# Altium project haptic_gloves.PrjPcb
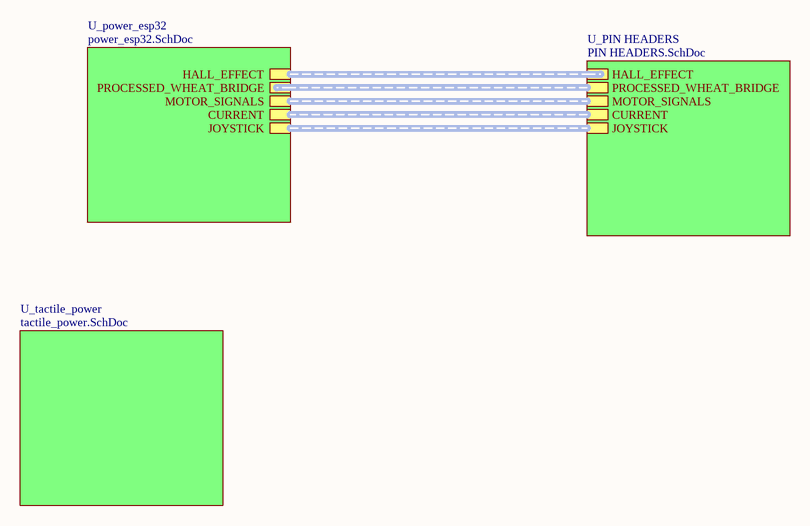
[diagram p0: MASTER_BLOXK.SchDoc]
5 sheets, 33 parts. Net scope: hierarchical (ports join the sheet entries above them; power ports are global).
Board file: SINGLE_BOARD.PcbDoc
Sheets:
  esp32-PLACEMENT.SchDoc
  MASTER_BLOXK.SchDoc
    U_PIN HEADERS = PIN HEADERS.SchDoc
    U_power_esp32 = power_esp32.SchDoc
    U_tactile_power = tactile_power.SchDoc

## Sheet esp32-PLACEMENT.SchDoc
size B; SheetNumber: 3; SheetTotal: 5

## Sheet MASTER_BLOXK.SchDoc
size B; SheetNumber: 2; SheetTotal: 5

### Sub-sheets
U_PIN HEADERS = PIN HEADERS.SchDoc: HALL_EFFECT (harness HALL_EFFECT), PROCESSED_WHEAT_BRIDGE (harness PROCES WHEAT_BRIDGE), CURRENT (harness current_sensors), MOTOR_SIGNALS (harness MOTOR_SIGNALS), JOYSTICK (harness JOY_STICK_)
U_power_esp32 = power_esp32.SchDoc: HALL_EFFECT (harness HALL_EFFECT), PROCESSED_WHEAT_BRIDGE (harness PROCES WHEAT_BRIDGE), MOTOR_SIGNALS (harness MOTOR_SIGNALS), CURRENT (harness current_sensors), JOYSTICK (harness JOY_STICK_)
U_tactile_power = tactile_power.SchDoc: no entries

### Buses and harness runs
harness sheet U_PIN HEADERS/CURRENT = sheet U_power_esp32/CURRENT
harness sheet U_PIN HEADERS/HALL_EFFECT = sheet U_power_esp32/HALL_EFFECT
harness sheet U_PIN HEADERS/JOYSTICK = sheet U_power_esp32/JOYSTICK
harness sheet U_PIN HEADERS/MOTOR_SIGNALS = sheet U_power_esp32/MOTOR_SIGNALS
harness sheet U_PIN HEADERS/PROCESSED_WHEAT_BRIDGE = sheet U_power_esp32/PROCESSED_WHEAT_BRIDGE

## Sheet PIN HEADERS.SchDoc
size B; SheetNumber: 4; SheetTotal: 5
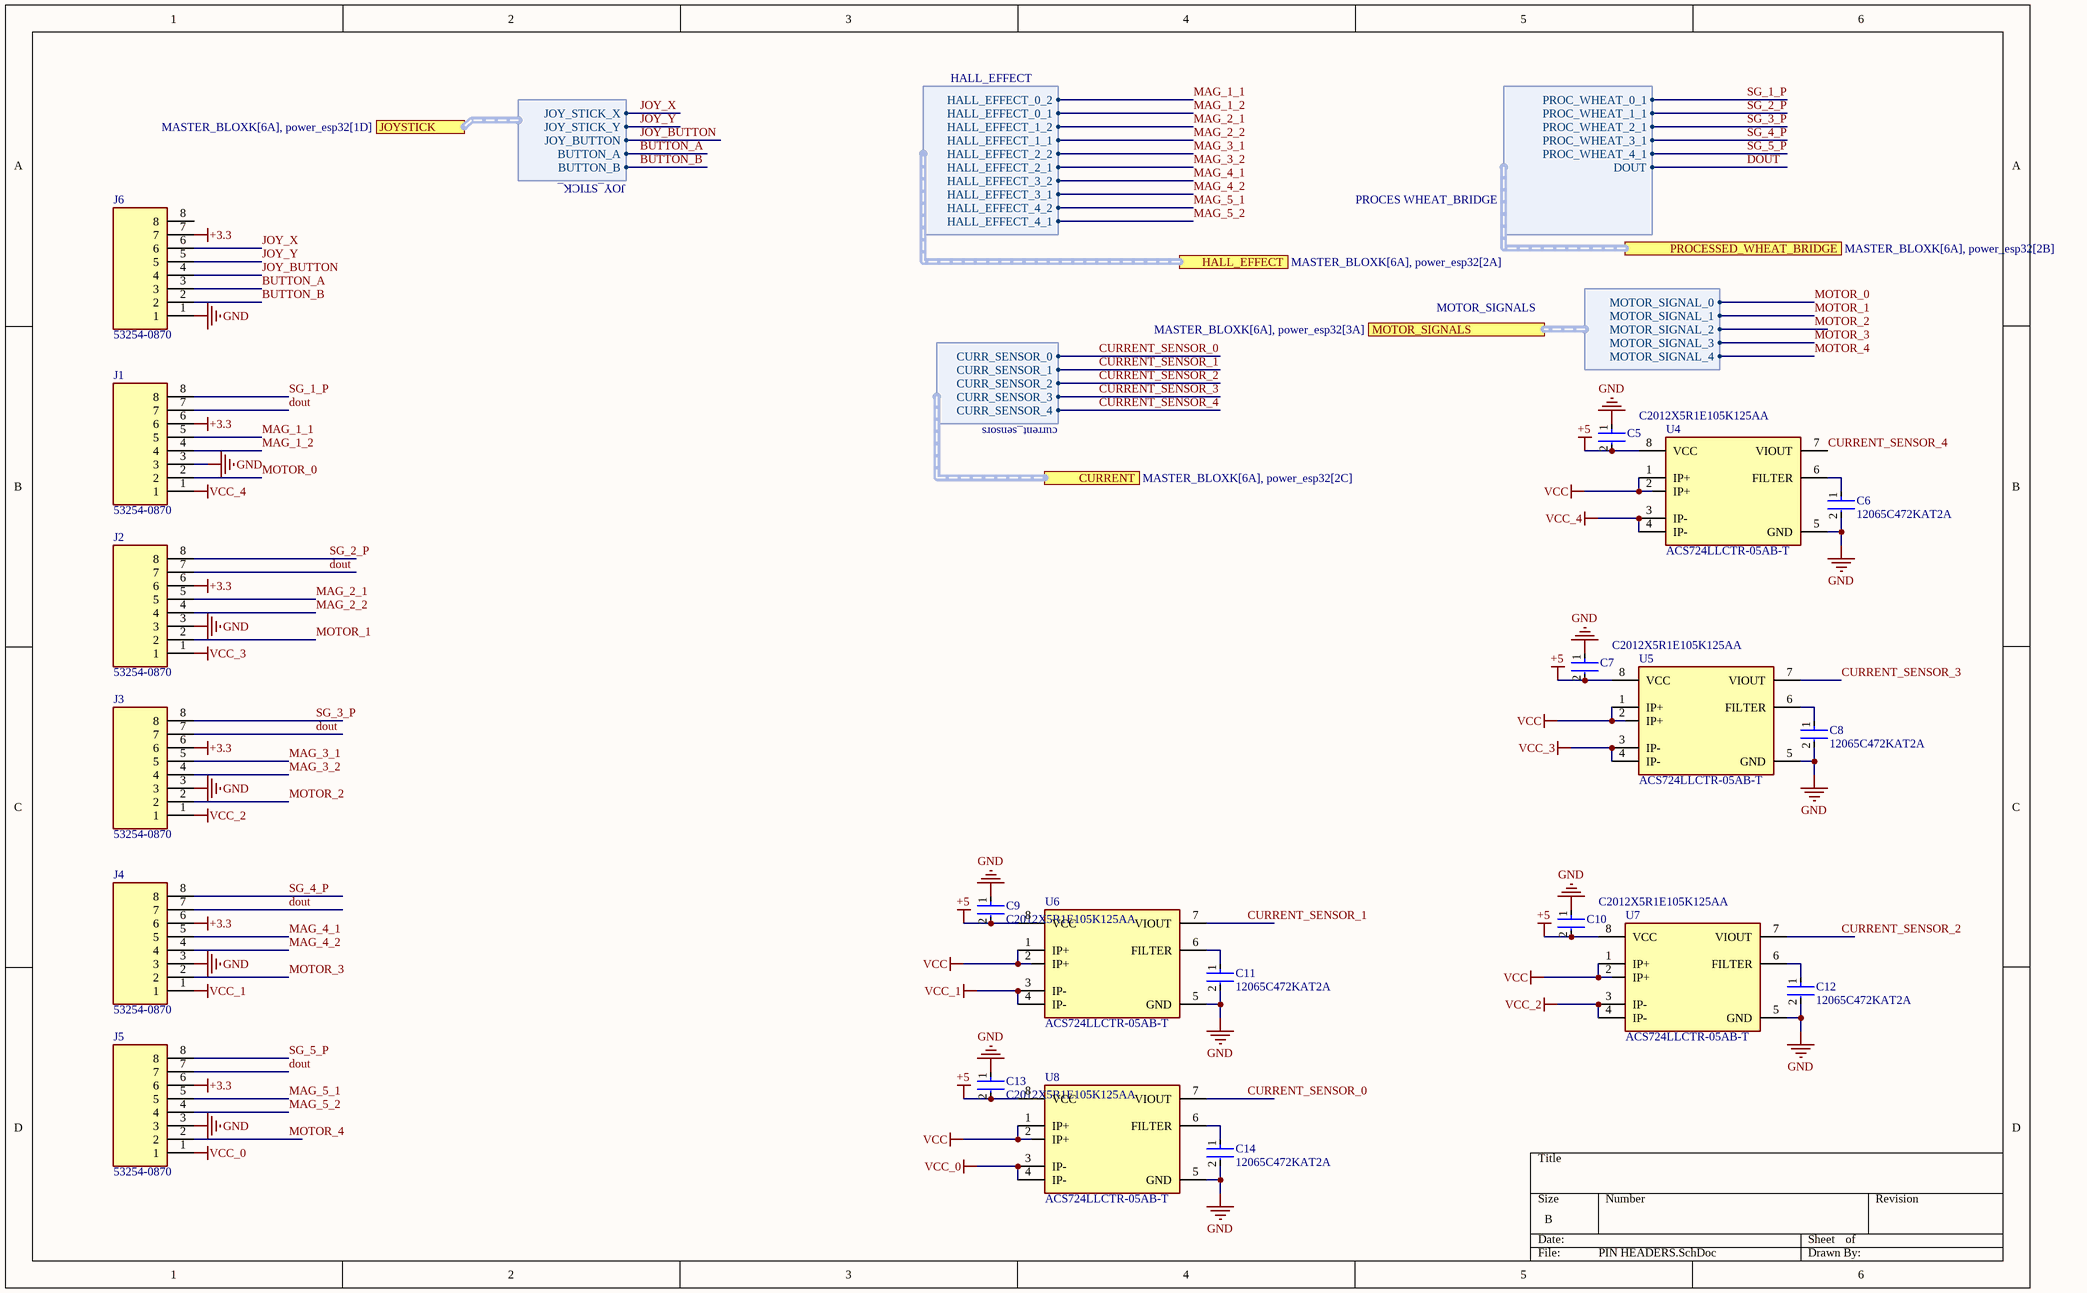
[diagram p1: PIN HEADERS.SchDoc]

### Parts
C5  C2012X5R1E105K125AA  [FP-C2012-125-0_2-IPC_A]
C6  12065C472KAT2A  [FP-1206-L_3_2_0_2-W_1_6_0-IPC_A]
C7  C2012X5R1E105K125AA  [FP-C2012-125-0_2-IPC_A]
C8  12065C472KAT2A  [FP-1206-L_3_2_0_2-W_1_6_0-IPC_A]
C9  C2012X5R1E105K125AA  [FP-C2012-125-0_2-IPC_A]
C10  C2012X5R1E105K125AA  [FP-C2012-125-0_2-IPC_A]
C11  12065C472KAT2A  [FP-1206-L_3_2_0_2-W_1_6_0-IPC_A]
C12  12065C472KAT2A  [FP-1206-L_3_2_0_2-W_1_6_0-IPC_A]
C13  C2012X5R1E105K125AA  [FP-C2012-125-0_2-IPC_A]
C14  12065C472KAT2A  [FP-1206-L_3_2_0_2-W_1_6_0-IPC_A]
J1  53254-0870  [SHDRRA8W50P0X200_1X8_1800X730X440P]
J2  53254-0870  [SHDRRA8W50P0X200_1X8_1800X730X440P]
J3  53254-0870  [SHDRRA8W50P0X200_1X8_1800X730X440P]
J4  53254-0870  [SHDRRA8W50P0X200_1X8_1800X730X440P]
J5  53254-0870  [SHDRRA8W50P0X200_1X8_1800X730X440P]
J6  53254-0870  [SHDRRA8W50P0X200_1X8_1800X730X440P]
U4  ACS724LLCTR-05AB-T  [FP-LCN-8-IPC_C]
U5  ACS724LLCTR-05AB-T  [FP-LCN-8-IPC_C]
U6  ACS724LLCTR-05AB-T  [FP-LCN-8-IPC_C]
U7  ACS724LLCTR-05AB-T  [FP-LCN-8-IPC_C]
U8  ACS724LLCTR-05AB-T  [FP-LCN-8-IPC_C]

### Ports
CURRENT (harness current_sensors, see MASTER_BLOXK[6A], power_esp32[2C]), HALL_EFFECT (harness HALL_EFFECT, see MASTER_BLOXK[6A], power_esp32[2A]), JOYSTICK (harness JOY_STICK_, see MASTER_BLOXK[6A], power_esp32[1D]), MOTOR_SIGNALS (harness MOTOR_SIGNALS, see MASTER_BLOXK[6A], power_esp32[3A]), PROCESSED_WHEAT_BRIDGE (harness PROCES WHEAT_BRIDGE, see MASTER_BLOXK[6A], power_esp32[2B])

### Harnesses
HALL_EFFECT: HALL_EFFECT_2_1, HALL_EFFECT_3_2, HALL_EFFECT_3_1, HALL_EFFECT_4_2, HALL_EFFECT_4_1, HALL_EFFECT_2_2, HALL_EFFECT_1_1, HALL_EFFECT_1_2, HALL_EFFECT_0_1, HALL_EFFECT_0_2
PROCES WHEAT_BRIDGE: PROC_WHEAT_0_1, PROC_WHEAT_1_1, PROC_WHEAT_2_1, PROC_WHEAT_3_1, PROC_WHEAT_4_1, DOUT
current_sensors: CURR_SENSOR_0, CURR_SENSOR_1, CURR_SENSOR_2, CURR_SENSOR_3, CURR_SENSOR_4
MOTOR_SIGNALS: MOTOR_SIGNAL_0, MOTOR_SIGNAL_1, MOTOR_SIGNAL_2, MOTOR_SIGNAL_3, MOTOR_SIGNAL_4
JOY_STICK_: JOY_STICK_X, JOY_STICK_Y, JOY_BUTTON, BUTTON_A, BUTTON_B

### Nets
+3.3: J1.6 J2.6 J3.6 J4.6 J5.6 J6.7
+5: C5.2 C7.2 C9.2 C10.2 C13.2 U4.8(VCC) U5.8(VCC) U6.8(VCC) U7.8(VCC) U8.8(VCC)
GND: C5.1 C6.2 C7.1 C8.2 C9.1 C10.1 C11.2 C12.2 C13.1 C14.2 J1.3 J2.3 J3.3 J4.3 J5.3 J6.1 U4.5(GND) U5.5(GND) U6.5(GND) U7.5(GND) U8.5(GND)
VCC: U4.1(IP+) U4.2(IP+) U5.1(IP+) U5.2(IP+) U6.1(IP+) U6.2(IP+) U7.1(IP+) U7.2(IP+) U8.1(IP+) U8.2(IP+)
VCC_0: J5.1 U8.3(IP-) U8.4(IP-)
VCC_1: J4.1 U6.3(IP-) U6.4(IP-)
VCC_2: J3.1 U7.3(IP-) U7.4(IP-)
VCC_3: J2.1 U5.3(IP-) U5.4(IP-)
VCC_4: J1.1 U4.3(IP-) U4.4(IP-)
BUTTON_A: J6.3 ; port JOYSTICK.BUTTON_A
BUTTON_B: J6.2 ; port JOYSTICK.BUTTON_B
CURRENT_SENSOR_0: U8.7(VIOUT) ; port CURRENT.CURR_SENSOR_0
CURRENT_SENSOR_1: U6.7(VIOUT) ; port CURRENT.CURR_SENSOR_1
CURRENT_SENSOR_2: U7.7(VIOUT) ; port CURRENT.CURR_SENSOR_2
CURRENT_SENSOR_3: U5.7(VIOUT) ; port CURRENT.CURR_SENSOR_3
CURRENT_SENSOR_4: U4.7(VIOUT) ; port CURRENT.CURR_SENSOR_4
dout: J1.7 J2.7 J3.7 J4.7 J5.7 ; port PROCESSED_WHEAT_BRIDGE.DOUT
JOY_BUTTON: J6.4 ; port JOYSTICK.JOY_BUTTON
JOY_X: J6.6 ; port JOYSTICK.JOY_STICK_X
JOY_Y: J6.5 ; port JOYSTICK.JOY_STICK_Y
MAG_1_1: J1.5 ; port HALL_EFFECT.HALL_EFFECT_0_2
MAG_1_2: J1.4 ; port HALL_EFFECT.HALL_EFFECT_0_1
MAG_2_1: J2.5 ; port HALL_EFFECT.HALL_EFFECT_1_2
MAG_2_2: J2.4 ; port HALL_EFFECT.HALL_EFFECT_1_1
MAG_3_1: J3.5 ; port HALL_EFFECT.HALL_EFFECT_2_2
MAG_3_2: J3.4 ; port HALL_EFFECT.HALL_EFFECT_2_1
MAG_4_1: J4.5 ; port HALL_EFFECT.HALL_EFFECT_3_2
MAG_4_2: J4.4 ; port HALL_EFFECT.HALL_EFFECT_3_1
MAG_5_1: J5.5 ; port HALL_EFFECT.HALL_EFFECT_4_2
MAG_5_2: J5.4 ; port HALL_EFFECT.HALL_EFFECT_4_1
MOTOR_0: J1.2 ; port MOTOR_SIGNALS.MOTOR_SIGNAL_0
MOTOR_1: J2.2 ; port MOTOR_SIGNALS.MOTOR_SIGNAL_1
MOTOR_2: J3.2 ; port MOTOR_SIGNALS.MOTOR_SIGNAL_2
MOTOR_3: J4.2 ; port MOTOR_SIGNALS.MOTOR_SIGNAL_3
MOTOR_4: J5.2 ; port MOTOR_SIGNALS.MOTOR_SIGNAL_4
SG_1_P: J1.8 ; port PROCESSED_WHEAT_BRIDGE.PROC_WHEAT_0_1
SG_2_P: J2.8 ; port PROCESSED_WHEAT_BRIDGE.PROC_WHEAT_1_1
SG_3_P: J3.8 ; port PROCESSED_WHEAT_BRIDGE.PROC_WHEAT_2_1
SG_4_P: J4.8 ; port PROCESSED_WHEAT_BRIDGE.PROC_WHEAT_3_1
SG_5_P: J5.8 ; port PROCESSED_WHEAT_BRIDGE.PROC_WHEAT_4_1
NetC6_1: C6.1 U4.6(FILTER)
NetC8_1: C8.1 U5.6(FILTER)
NetC11_1: C11.1 U6.6(FILTER)
NetC12_1: C12.1 U7.6(FILTER)
NetC14_1: C14.1 U8.6(FILTER)

Not connected (* = marked no-connect by the designer): J6 8

### Library data of the parts
C5 C7 C9 C10 C13 = CMP-08246-005389-1: Multilayer Ceramic Capacitors 1μF ±10% 25V X5R SMD 0805; Capacitance: 1uF; Min Operating Temperature: -55°C; Construction: Flat; Package Quantity: 2000; Height: 1.25mm; Resistor Type: Ceramic; Case/Package: 0805; Depth: 1.25mm; Case Code (Metric): 2012; Weight: 0.000194oz; REACH SVHC: No SVHC; Dielectric: X5R; Max Operating Temperature: 85°C; Number of Pins: 2; Thickness: 0.057inch; RoHS Compliant: Yes; Radiation Hardening: No; Lead Free: Lead Free; Case Code (Imperial): 0805; Length: 2mm; Voltage Rating: 25V; Mount: Surface Mount; Voltage Rating (DC): 25V; Packaging: Tape and Reel; Dielectric Material: Ceramic; Termination: SMD/SMT; Voltage: 25V; Tolerance: 10%; Series: C; Width: 0.049inch
C6 C8 C11 C12 C14 = CMP-04427-019159-1: General Purpose Ceramic Capacitor, 1206, 4.7nF, 10%, X7R, 15%, 50V; Dissipation Factor: 2.5%; Min Operating Temperature: -55°C; Length: 3.2mm; Mount: Surface Mount; Case Code (Metric): 3216; Depth: 1.6mm; Voltage Rating (DC): 50V; Dielectric Material: Ceramic; Termination: SMD/SMT; Radiation Hardening: No; Voltage: 50V; Capacitance: 4.7nF; Dielectric: X7R; Series: -; Max Operating Temperature: 125°C; Lead Free: Lead Free; Number of Pins: 2; Tolerance: 10%; Thickness: 0.037inch; Packaging: Tape and Reel; Package Quantity: 1; Case/Package: 1206; Contact Plating: Tin; Construction: Flat; Height: 0.94mm; Voltage Rating: 50V; RoHS Compliant: Yes; Width: 1.6mm; Case Code (Imperial): 1206
J1-J6 = CMP-003-000027-1: Headers & Wire Housings 8CKT WTB R/A; Manufacturer_Name: Molex; Geometry.Height: 4.4mm; Mouser Price/Stock: https://www.mouser.co.uk/ProductDetail/Molex/53254-0870?qs=s16%252Be%252B8QgeFQnKbK1eobMw%3D%3D; Mouser Part Number: 538-53254-0870; Source: 53254-0870.SchLib; Design Item ID: 53254-0870; Manufacturer_Part_Number: 53254-0870; Datasheet Link: https://componentsearchengine.com/Datasheets/2/53254-0870.pdf
U4-U8 = CMP-82923-000070-2: SENSOR CURRENT HALL; Current Sensing: 5A; Number of Channels: 1; Sensitivity: 400mV/A; Linearity: 1.5%; Polarity: Bidirectional; Response Time: 4us; Frequency: 120kHz; Max Supply Current: 14mA; Accuracy: 0.6%; Min Operating Temperature: -40°C; Mount: Surface Mount; Max Operating Temperature: 150°C; Packaging: Tape and Reel; RoHS Compliant: Yes; Case/Package: SOIC

## Sheet power_esp32.SchDoc
size B; SheetNumber: 5; SheetTotal: 5
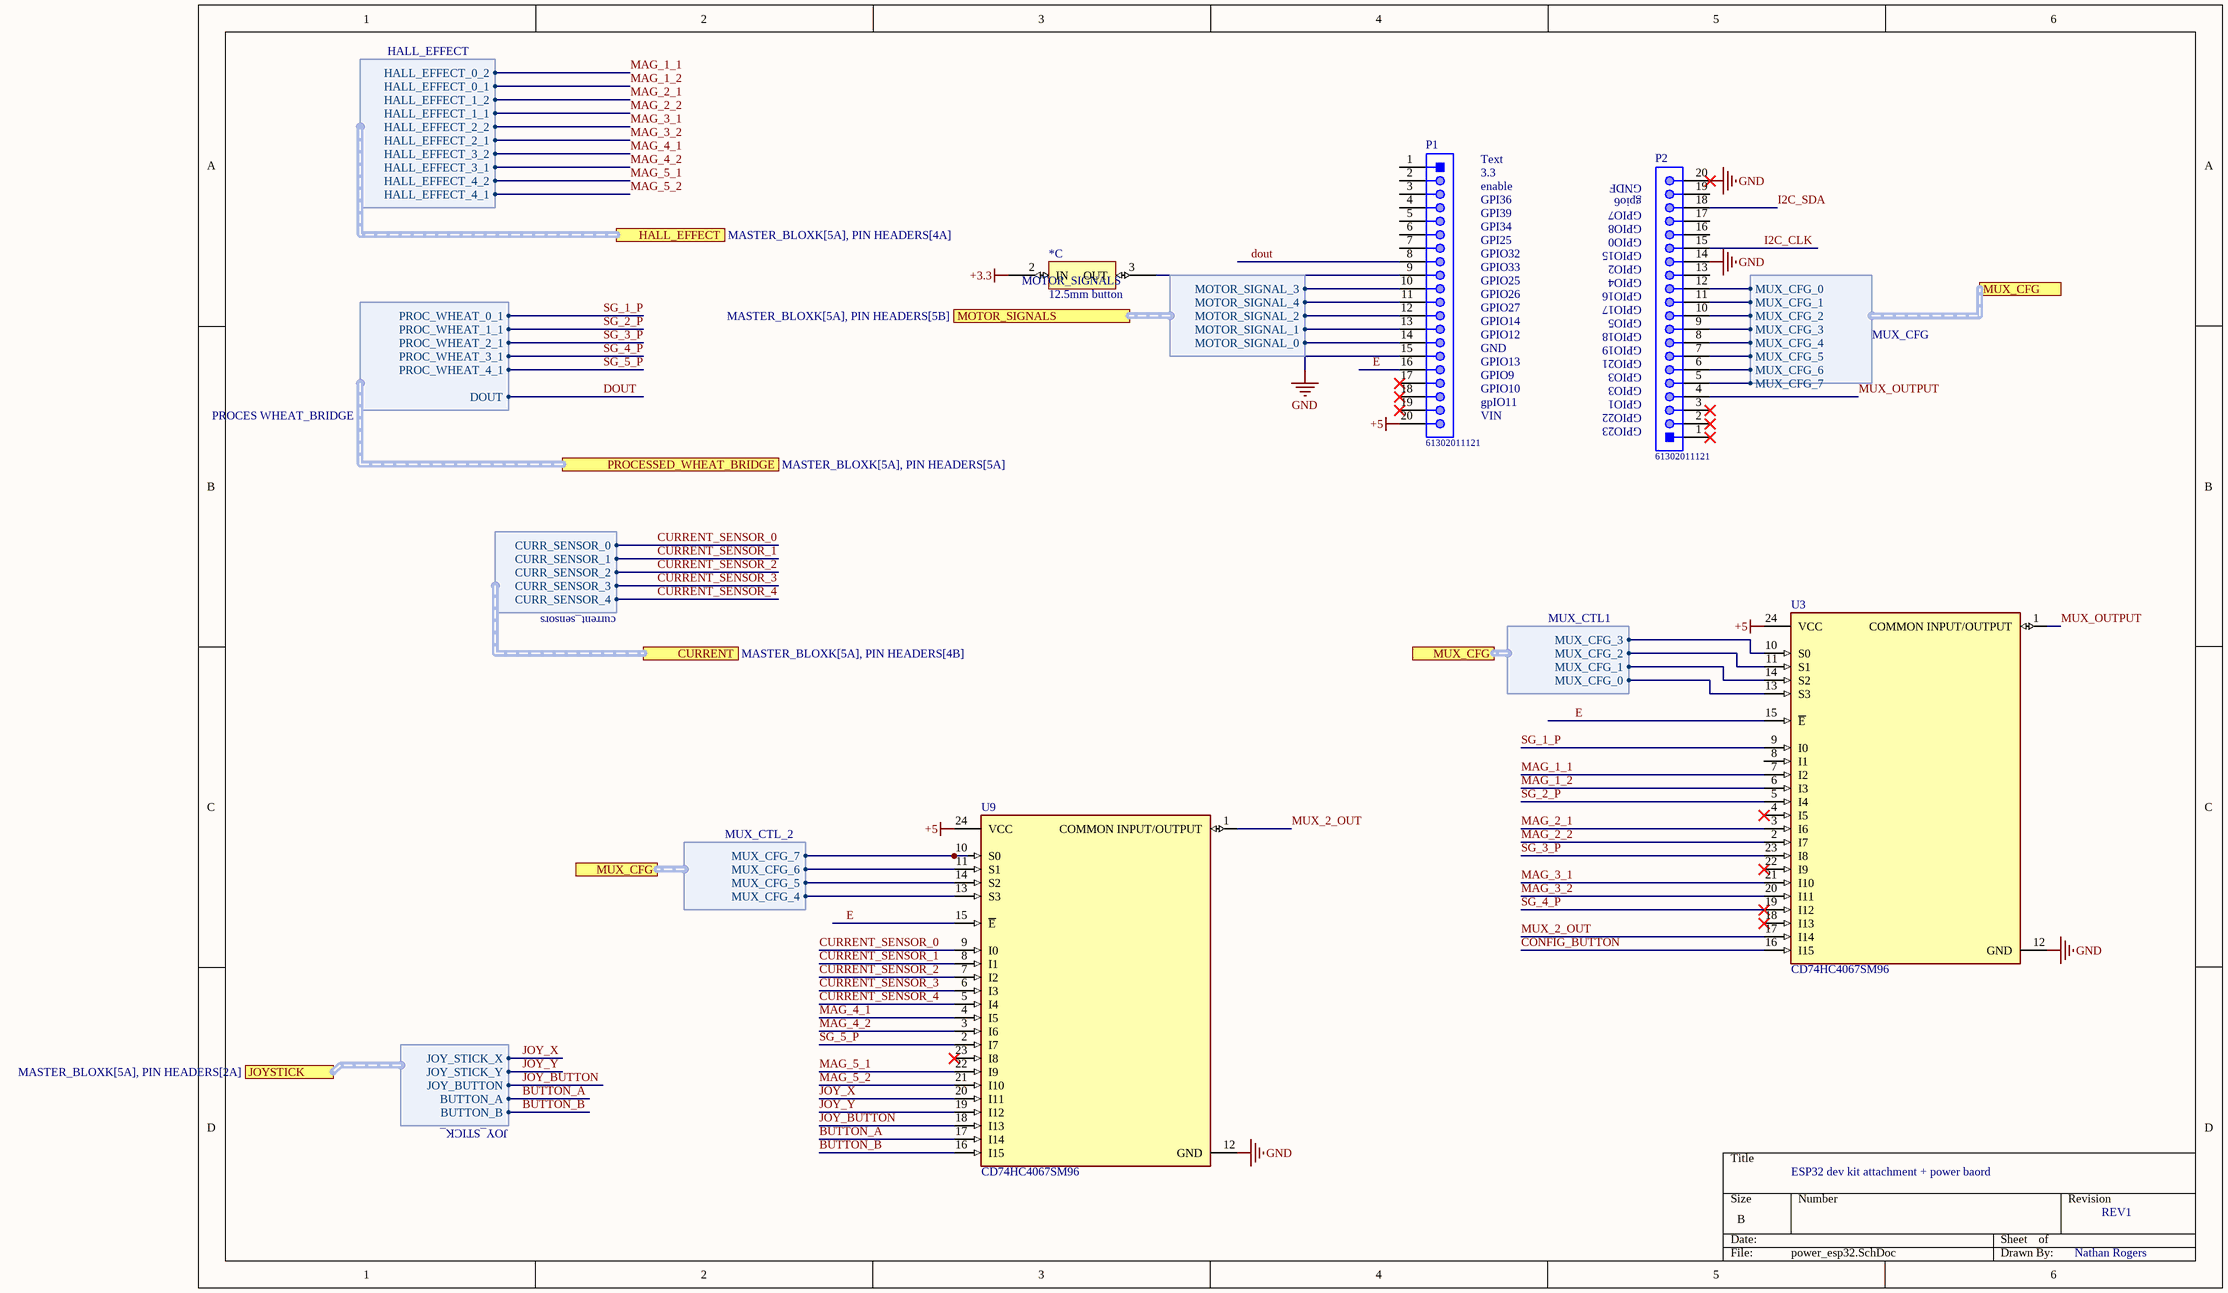
[diagram p2: power_esp32.SchDoc]

### Parts
*  12.5mm button  [12.5mm button-Footprint-1]  (part C of 3)
P1  61302011121  [61302011121]
P2  61302011121  [61302011121]
U3  CD74HC4067SM96  [FP-DB0024A-IPC_C]
U9  CD74HC4067SM96  [FP-DB0024A-IPC_C]

### Ports
CURRENT (harness current_sensors, see MASTER_BLOXK[5A], PIN HEADERS[4B]), HALL_EFFECT (harness HALL_EFFECT, see MASTER_BLOXK[5A], PIN HEADERS[4A]), JOYSTICK (harness JOY_STICK_, see MASTER_BLOXK[5A], PIN HEADERS[2A]), MOTOR_SIGNALS (harness MOTOR_SIGNALS, see MASTER_BLOXK[5A], PIN HEADERS[5B]), MUX_CFG (harness MUX_CFG), MUX_CFG (harness MUX_ctl1), MUX_CFG (harness MUX_CTL_2), PROCESSED_WHEAT_BRIDGE (harness PROCES WHEAT_BRIDGE, see MASTER_BLOXK[5A], PIN HEADERS[5A])

### Harnesses
MUX_CTL1: MUX_CFG_0, MUX_CFG_1, MUX_CFG_2, MUX_CFG_3
HALL_EFFECT: HALL_EFFECT_2_1, HALL_EFFECT_3_2, HALL_EFFECT_3_1, HALL_EFFECT_4_2, HALL_EFFECT_4_1, HALL_EFFECT_2_2, HALL_EFFECT_1_1, HALL_EFFECT_1_2, HALL_EFFECT_0_1, HALL_EFFECT_0_2
PROCES WHEAT_BRIDGE: PROC_WHEAT_0_1, PROC_WHEAT_1_1, PROC_WHEAT_2_1, PROC_WHEAT_3_1, PROC_WHEAT_4_1, DOUT
MUX_CTL_2: MUX_CFG_4, MUX_CFG_5, MUX_CFG_6, MUX_CFG_7
MOTOR_SIGNALS: MOTOR_SIGNAL_0, MOTOR_SIGNAL_1, MOTOR_SIGNAL_2, MOTOR_SIGNAL_3, MOTOR_SIGNAL_4
MUX_CFG: MUX_CFG_0, MUX_CFG_1, MUX_CFG_2, MUX_CFG_3, MUX_CFG_4, MUX_CFG_5, MUX_CFG_6, MUX_CFG_7
current_sensors: CURR_SENSOR_0, CURR_SENSOR_1, CURR_SENSOR_2, CURR_SENSOR_3, CURR_SENSOR_4
JOY_STICK_: JOY_STICK_X, JOY_STICK_Y, JOY_BUTTON, BUTTON_A, BUTTON_B

### Nets
+3.3: *.2(IN)
+5: P1.20 U3.24(VCC) U9.24(VCC)
GND: P1.15 P2.14 P2.20 U3.12(GND) U9.12(GND)
BUTTON_A: U9.17(I14) ; port JOYSTICK.BUTTON_A
BUTTON_B: U9.16(I15) ; port JOYSTICK.BUTTON_B
CONFIG_BUTTON: U3.16(I15)
CURRENT_SENSOR_0: U9.9(I0) ; port CURRENT.CURR_SENSOR_0
CURRENT_SENSOR_1: U9.8(I1) ; port CURRENT.CURR_SENSOR_1
CURRENT_SENSOR_2: U9.7(I2) ; port CURRENT.CURR_SENSOR_2
CURRENT_SENSOR_3: U9.6(I3) ; port CURRENT.CURR_SENSOR_3
CURRENT_SENSOR_4: U9.5(I4) ; port CURRENT.CURR_SENSOR_4
dout: P1.8 ; port PROCESSED_WHEAT_BRIDGE.DOUT
E: P1.16 U3.15(~{E}) U9.15(~{E})
I2C_CLK: P2.15
I2C_SDA: P2.18
JOY_BUTTON: U9.18(I13) ; port JOYSTICK.JOY_BUTTON
JOY_X: U9.20(I11) ; port JOYSTICK.JOY_STICK_X
JOY_Y: U9.19(I12) ; port JOYSTICK.JOY_STICK_Y
MAG_1_1: U3.7(I2) ; port HALL_EFFECT.HALL_EFFECT_0_2
MAG_1_2: U3.6(I3) ; port HALL_EFFECT.HALL_EFFECT_0_1
MAG_2_1: U3.3(I6) ; port HALL_EFFECT.HALL_EFFECT_1_2
MAG_2_2: U3.2(I7) ; port HALL_EFFECT.HALL_EFFECT_1_1
MAG_3_1: U3.21(I10) ; port HALL_EFFECT.HALL_EFFECT_2_2
MAG_3_2: U3.20(I11) ; port HALL_EFFECT.HALL_EFFECT_2_1
MAG_4_1: U9.4(I5) ; port HALL_EFFECT.HALL_EFFECT_3_2
MAG_4_2: U9.3(I6) ; port HALL_EFFECT.HALL_EFFECT_3_1
MAG_5_1: U9.22(I9) ; port HALL_EFFECT.HALL_EFFECT_4_2
MAG_5_2: U9.21(I10) ; port HALL_EFFECT.HALL_EFFECT_4_1
MOTOR_0: P1.14 ; port MOTOR_SIGNALS.MOTOR_SIGNAL_0
MOTOR_1: P1.13 ; port MOTOR_SIGNALS.MOTOR_SIGNAL_1
MOTOR_2: P1.12 ; port MOTOR_SIGNALS.MOTOR_SIGNAL_2
MOTOR_3: P1.10 ; port MOTOR_SIGNALS.MOTOR_SIGNAL_3
MOTOR_4: P1.11 ; port MOTOR_SIGNALS.MOTOR_SIGNAL_4
MUX_2_OUT: U3.17(I14) U9.1(COMMON_INPUT/OUTPUT)
MUX_OUTPUT: P2.4 U3.1(COMMON_INPUT/OUTPUT)
SG_1_P: U3.9(I0) ; port PROCESSED_WHEAT_BRIDGE.PROC_WHEAT_0_1
SG_2_P: U3.5(I4) ; port PROCESSED_WHEAT_BRIDGE.PROC_WHEAT_1_1
SG_3_P: U3.23(I8) ; port PROCESSED_WHEAT_BRIDGE.PROC_WHEAT_2_1
SG_4_P: U3.19(I12) ; port PROCESSED_WHEAT_BRIDGE.PROC_WHEAT_3_1
SG_5_P: U9.2(I7) ; port PROCESSED_WHEAT_BRIDGE.PROC_WHEAT_4_1
Net*_3: *.3(OUT) P1.9
NetP2_5: P2.5 U9.10(S0) ; port MUX_CFG.MUX_CFG_7
NetP2_6: P2.6 U9.11(S1) ; port MUX_CFG.MUX_CFG_6
NetP2_7: P2.7 U9.14(S2) ; port MUX_CFG.MUX_CFG_5
NetP2_8: P2.8 U9.13(S3) ; port MUX_CFG.MUX_CFG_4
NetP2_9: P2.9 U3.10(S0) ; port MUX_CFG.MUX_CFG_3
NetP2_10: P2.10 U3.11(S1) ; port MUX_CFG.MUX_CFG_2
NetP2_11: P2.11 U3.14(S2) ; port MUX_CFG.MUX_CFG_1
NetP2_12: P2.12 U3.13(S3) ; port MUX_CFG.MUX_CFG_0

Not connected (* = marked no-connect by the designer): P1 1 2 3 4 5 6 7 17* 18* 19*; P2 1* 2* 3* 13 16 17 19; U3 4(I5)* 8(I1) 18(I13)* 22(I9)*; U9 23(I8)*

### Notes on the sheet
- Text
- 3.3
- enable
- GPI36
- GPI39
- GPI34
- (near P2) GPIO0
- (near P2) GPIO8
- (near P2) GPIO7
- (near P2) gpio6
- (near P2) GNDF
- GPI25
- GPIO32
- GPIO33
- GPIO25
- GPIO26
- (near P2) GPIO17
- (near P2) GPIO16
- (near P2) GPIO4
- (near P2) GPIO2
- (near P2) GPIO15
- GPIO27
- GPIO14
- GPIO12
- GND
- GPIO13
- (near P2) GPIO3
- (near P2) GPIO21
- (near P2) GPIO19
- (near P2) GPIO18
- (near P2) GPIO5
- GPIO9
- GPIO10
- gpIO11
- VIN
- (near P2) GPIO23
- (near P2) GPIO1
- (near P2) GPIO22
- ESP32 dev kit attachment + power baord
- REV1
- Nathan Rogers

### Library data of the parts
* = CMP-00027-1: Spacer, Round, 1/4 Inch O.D., 1/4 Inch Long, #8 Hole, Phenolic; Throw Configuration: SPST; Actuator Type: Standard; Termination: PC Pin; Mount: Through Hole; Series: -
P1 P2 = CMP-1502-01102-1: THT Vertical Pin Header WR-PHD, Pitch 2.54 mm, Single Row, 20 pins; Manufacturer: Wurth Elektronik; Withstanding Voltage: 500VAC; Gender: Male; Pin Number: 20; Rated Current: 3A; Contact Resistance: 20mOhm; Pitch: 2.54mm; Working Voltage: 250VAC; Publisher: WurthElektronik; Packaging: Bag; Datasheet URL: https://katalog.we-online.de/em/datasheet/6130xx11121.pdf; Row Number: Single; Mounting Technology: THT; Manufacturer URL: http://www.we-online.de; Orientation: Vertical; Package Reference: 61302011121; Part Number: 61302011121; Operating Temperature: -40to105degC
U3 U9 = CMP-04892-000038-1: IC MUX/DEMUX 1X16 24SSOP; Supply Type: Single; High Level Output Current: 25mA; Min Supply Voltage: 2V; Number of Circuits: 16; Max Supply Voltage: 6V; Number of Channels: 1; Turn-On Delay Time: 300ns; Max Supply Current: 8uA; Bandwidth: 89MHz; Turn-Off Delay Time: 290ns; Propagation Delay: 75ns; Logic Function: Multiplexer; On-State Resistance: 160R; Polarity: Non-Inverting; Width: 5.3mm; Case/Package: SSOP; Max Operating Temperature: 125°C; Mount: Surface Mount; Min Operating Temperature: -55°C; REACH SVHC: No SVHC; Contact Plating: Gold; Max Output Current: 25mA; Weight: 0.006081oz; Height: 1.95mm; Package Quantity: 2000; Length: 8.2mm; Lead Free: Lead Free; Operating Supply Current: 8uA; Packaging: Tape and Reel; Series: 74HC; Low Level Output Current: 25mA; Number of Outputs: 1; Termination: SMD/SMT; Number of Inputs: 16; Number of Bits: 16; Radiation Hardening: No; Number of Pins: 24

## Sheet tactile_power.SchDoc
size A; SheetNumber: 1; SheetTotal: 5
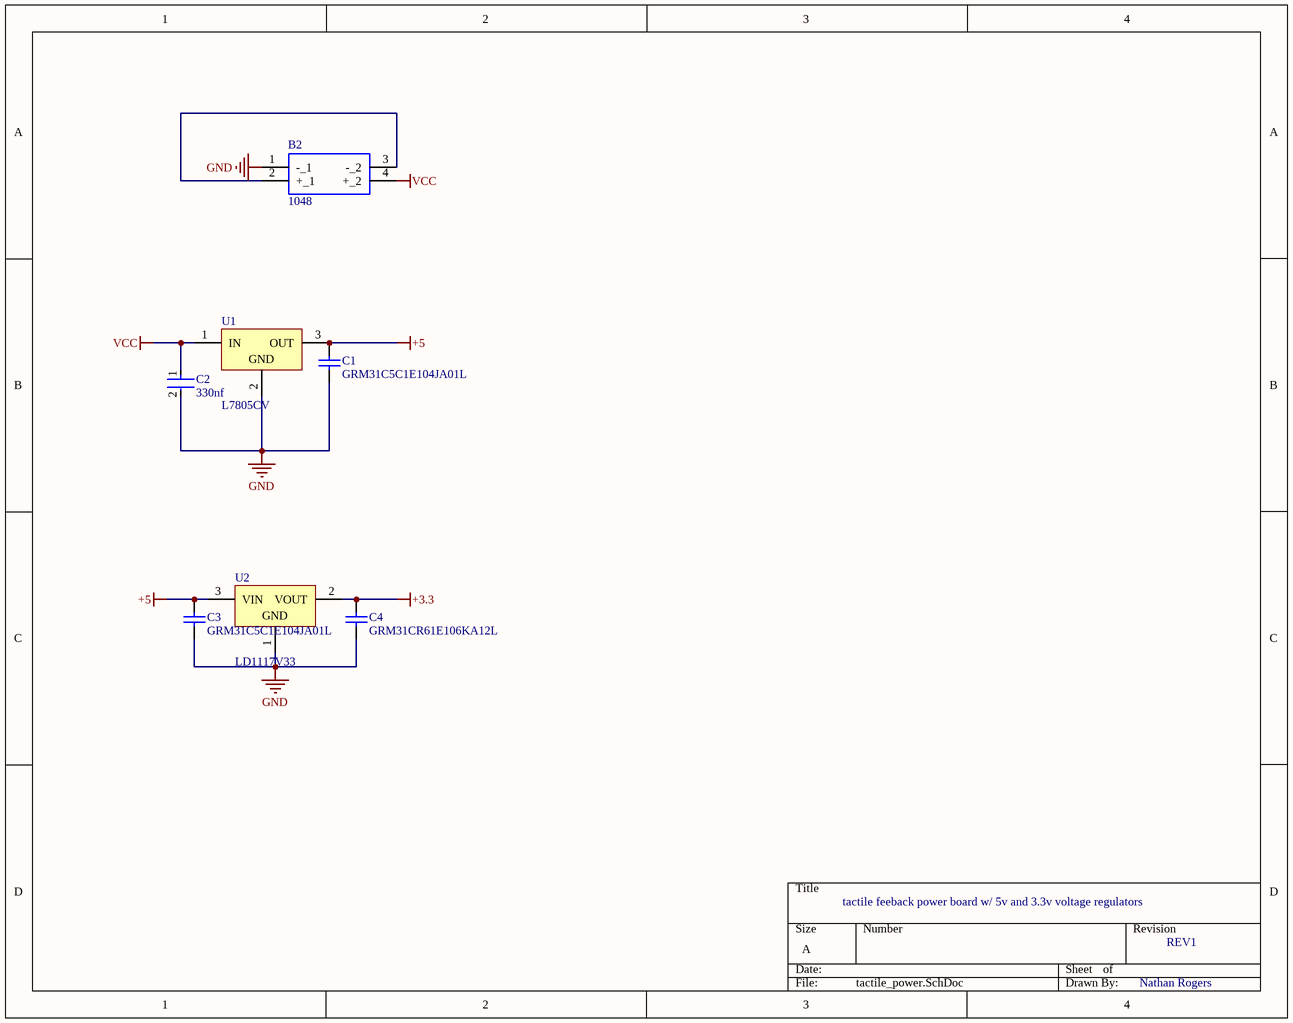
[diagram p3: tactile_power.SchDoc]

### Parts
B2  1048  [1048]
C1  GRM31C5C1E104JA01L  [CAPC3216X180X55LL20T25]
C2  330nf  [FP-1206-L_3_2_0_2-W_1_6_0-IPC_B]
C3  GRM31C5C1E104JA01L  [CAPC3216X180X55LL20T25]
C4  GRM31CR61E106KA12L  [CAPC3216X180X55ML20T25]
U1  L7805CV  [TO220]
U2  LD1117V33  [TO220]

### Nets
+3.3: C4.2 U2.2(VOUT)
+5: C1.2 C3.2 U1.3(OUT) U2.3(VIN)
GND: B2.1(-_1) C1.1 C2.2 C3.1 C4.1 U1.2(GND) U2.1(GND)
VCC: B2.4(+_2) C2.1 U1.1(IN)
NetB2_2: B2.2(+_1) B2.3(-_2)

### Notes on the sheet
- tactile feeback power board w/ 5v and 3.3v voltage regulators
- REV1
- Nathan Rogers

### Library data of the parts
B2 = CMP-003-000009-1: KEYSTONE - 1048 - BATTERY HOLDER, 18650 LI-ION, 2CELL, SMD; Manufacturer_Name: Keystone Electronics; Source: 1048.SchLib; Design Item ID: 1048; Mouser Part Number: 534-1048; Mouser Price/Stock: https://www.mouser.co.uk/ProductDetail/Keystone-Electronics/1048?qs=%2F7TOpeL5Mz5jXkg8vI8Dyw%3D%3D; Manufacturer_Part_Number: 1048; Datasheet Link: http://www.keyelco.com/product-pdf.cfm?p=920
C1 C3 = CMP-2000-06343-1: Chip Capacitor, 100 nF, +/- 5%, 25 V, -55 to 125 degC, 1206 (3216 Metric), RoHS, Tape and Reel; Manufacturer: Murata; External Width: 0.5mm; Voltage Rating V DC: 25V; Capacitor Case Style: 1206[3216Metric]; Insulation Resistance: 10000Mohm; Capacitor Terminals: SMD; Capacitance: 0.1µF; Temperature Coefficient: 0ppm/°C±30ppm/°C; External Length / Height: 1mm; Reel Quantity: 2000; Dielectric Characteristic: C0G/NP0; SVHC: NoSVHC(19-Dec-2012); No. of Pins: 2; Manufacturer URL: http://www.murata.com/; Mounting Technology: SurfaceMount; Operating Temperature Range: -55°Cto+125°C; Operating Temperature Max: 125°C; Package Description: 2-Pin Surface Mount Device, Body 3.2 x 1.6 mm; Operating Temperature Min: -55°C; Terminal Type: SurfaceMount(SMD,SMT); MSL: –; Tolerance +: 5%; Voltage Rating: 25V; Datasheet URL: https://datasheet.ciiva.com/3777/11308grm31c5c1e104ja0123-3777177.pdf; Datasheet Version: 09/2014; Package / Case: 1206; Capacitance Tolerance: ±5%; Package Reference: 1206; Lead Spacing: –; Tolerance -: 5%
C2 = CMP-2000-05868-2: General Purpose Ceramic Capacitor, 1206, 330nF, 10%, X7R, 15%, 50V; Insulation Resistance: 100GR; Dissipation Factor: 2.5%; Voltage: 25V; Max Operating Temperature: 125°C; Packaging: Tape and Reel; Number of Pins: 2; Construction: Flat; Tolerance: 10%; RoHS Compliant: Yes; Lead Free: Lead Free; Mount: Surface Mount; Voltage Rating: 50V; Voltage Rating (DC): 50V; Width: 1.6mm; Height: 1.52mm; Termination: SMD/SMT; Min Operating Temperature: -55°C; Contact Plating: Tin; REACH SVHC: No SVHC; Case Code (Imperial): 1206; Thickness: 0.06inch; Radiation Hardening: No; Capacitance: 330nF; Case/Package: 1206; Case Code (Metric): 3216; Dielectric: X7R; Depth: 1.6mm; Dielectric Material: Ceramic; Series: 1206; Package Quantity: 1; Length: 3.2mm
C4 = CMP-2000-04947-1: Chip Capacitor, 10 uF, +/- 10%, 25 V, -55 to 85 degC, 1206 (3216 Metric), RoHS, Tape and Reel; Manufacturer: Murata; Case Height: 1.6mm; Voltage Rating DC: 25V; Capacitance: 10uF; Type: GeneralPurposeMLCC; Dielectric: X5R; Case Length: 3.2mm; Brand: MurataElectronics; Maximum Operating Temperature: +85C; Datasheet URL: https://datasheet.ciiva.com/11786/0900766b80ef921d-11786983.pdf; Tolerance: 10%; Case Code - mm: 3216; Datasheet Version: Sep-13; Packaging: Reel; Product Category: MultilayerCeramicCapacitorsMLCC-SMD/SMT; Manufacturer URL: http://www.murata.com/; Factory Pack Quantity: 2000; Minimum Operating Temperature: -55C; Product: GeneralTypeMLCCs; Package Reference: 1206; RoHS: Details; Package / Case: 1206(3216metric); Package Description: 2-Pin Surface Mount Device, Body 3.2 x 1.6 mm; Case Code - in: 1206; Termination Style: SMD/SMT; Series: GRM; Case Width: 1.6mm
U1 = CMP-0244-00483-1: Positive Voltage Regulator, 5V, 3-Pin TO-220; PackageDescription: TO, Thru-Hole, Vertical, Heatsink Mounted; 3 In-Line Leads; Pitch 2.54 mm; ComponentLink2Description: Datasheet; PackageReference: TO220; ComponentLink3URL: http://www.st.com/internet/com/TECHNICAL_RESOURCES/TECHNICAL_LITERATURE/PACKAGE_INFORMATION/CD00004649.pdf; DatasheetVersion: 16/11/2011; ComponentLink1Description: Manufacturer URL; ComponentLink1URL: http://www.st.com; PackageVersion: ver3.0; ComponentLink3Description: Package Specification; ComponentLink2URL: http://www.st.com/internet/com/TECHNICAL_RESOURCES/TECHNICAL_LITERATURE/DATASHEET/CD00000444.pdf
U2 = CMP-0244-00470-1: Fixed Low Drop Positive Voltage Regulator, 3.3V, 3-Pin TO-220; PackageVersion: ver3.0; PackageDescription: TO, Thru-Hole, Vertical, Heatsink Mounted; 3 In-Line Leads; Pitch 2.54 mm; ComponentLink1Description: Manufacturer URL; ComponentLink3URL: http://www.st.com/internet/com/TECHNICAL_RESOURCES/TECHNICAL_LITERATURE/PACKAGE_INFORMATION/CD00004649.pdf; PackageReference: TO220; ComponentLink2URL: http://www.st.com/internet/com/TECHNICAL_RESOURCES/TECHNICAL_LITERATURE/DATASHEET/CD00000544.pdf; ComponentLink3Description: Package Specification; ComponentLink2Description: Datasheet; ComponentLink1URL: http://www.st.com; DatasheetVersion: 1/11/2011

## Nets that join several sheets
+3.3: PIN HEADERS (6 pins), power_esp32 (*.2), tactile_power (C4.2 U2.2)
+5: PIN HEADERS (10 pins), power_esp32 (P1.20 U3.24 U9.24), tactile_power (C1.2 C3.2 U1.3 U2.3)
GND: PIN HEADERS (21 pins), power_esp32 (5 pins), tactile_power (7 pins)
VCC: PIN HEADERS (10 pins), tactile_power (B2.4 C2.1 U1.1)
BUTTON_A: PIN HEADERS (J6.3), power_esp32 (U9.17)
BUTTON_B: PIN HEADERS (J6.2), power_esp32 (U9.16)
CURRENT_SENSOR_0: PIN HEADERS (U8.7), power_esp32 (U9.9)
CURRENT_SENSOR_1: PIN HEADERS (U6.7), power_esp32 (U9.8)
CURRENT_SENSOR_2: PIN HEADERS (U7.7), power_esp32 (U9.7)
CURRENT_SENSOR_3: PIN HEADERS (U5.7), power_esp32 (U9.6)
CURRENT_SENSOR_4: PIN HEADERS (U4.7), power_esp32 (U9.5)
dout: PIN HEADERS (5 pins), power_esp32 (P1.8)
JOY_BUTTON: PIN HEADERS (J6.4), power_esp32 (U9.18)
JOY_X: PIN HEADERS (J6.6), power_esp32 (U9.20)
JOY_Y: PIN HEADERS (J6.5), power_esp32 (U9.19)
MAG_1_1: PIN HEADERS (J1.5), power_esp32 (U3.7)
MAG_1_2: PIN HEADERS (J1.4), power_esp32 (U3.6)
MAG_2_1: PIN HEADERS (J2.5), power_esp32 (U3.3)
MAG_2_2: PIN HEADERS (J2.4), power_esp32 (U3.2)
MAG_3_1: PIN HEADERS (J3.5), power_esp32 (U3.21)
MAG_3_2: PIN HEADERS (J3.4), power_esp32 (U3.20)
MAG_4_1: PIN HEADERS (J4.5), power_esp32 (U9.4)
MAG_4_2: PIN HEADERS (J4.4), power_esp32 (U9.3)
MAG_5_1: PIN HEADERS (J5.5), power_esp32 (U9.22)
MAG_5_2: PIN HEADERS (J5.4), power_esp32 (U9.21)
MOTOR_0: PIN HEADERS (J1.2), power_esp32 (P1.14)
MOTOR_1: PIN HEADERS (J2.2), power_esp32 (P1.13)
MOTOR_2: PIN HEADERS (J3.2), power_esp32 (P1.12)
MOTOR_3: PIN HEADERS (J4.2), power_esp32 (P1.10)
MOTOR_4: PIN HEADERS (J5.2), power_esp32 (P1.11)
SG_1_P: PIN HEADERS (J1.8), power_esp32 (U3.9)
SG_2_P: PIN HEADERS (J2.8), power_esp32 (U3.5)
SG_3_P: PIN HEADERS (J3.8), power_esp32 (U3.23)
SG_4_P: PIN HEADERS (J4.8), power_esp32 (U3.19)
SG_5_P: PIN HEADERS (J5.8), power_esp32 (U9.2)